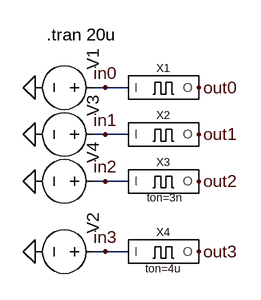
[diagram p0: schematic test-twoshot.asc]
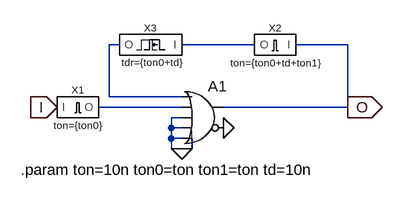
[diagram p1: sub-circuit twoshot.asc]
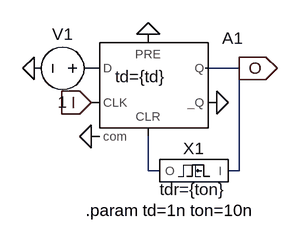
[diagram p2: sub-circuit oneshot.asc]
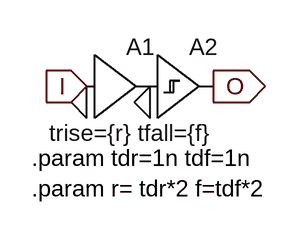
[diagram p3: sub-circuit delay.asc]
test-twoshot.asc, the LTspice schematic file:
Version 4
SHEET 1 880 680
WIRE 128 256 112 256
WIRE 160 256 128 256
WIRE 128 320 112 320
WIRE 160 320 128 320
WIRE 128 384 112 384
WIRE 160 384 128 384
WIRE 128 480 112 480
WIRE 160 480 128 480
FLAG 32 256 0
FLAG 256 256 out0
FLAG 128 256 in0
FLAG 32 320 0
FLAG 256 320 out1
FLAG 128 320 in1
FLAG 32 384 0
FLAG 256 384 out2
FLAG 128 384 in2
FLAG 32 480 0
FLAG 256 480 out3
FLAG 128 480 in3
SYMBOL voltage 128 256 M270
WINDOW 3 24 96 Invisible 2
WINDOW 123 0 0 Left 0
WINDOW 39 0 0 Left 0
SYMATTR Value PULSE(0 1 1u 1n 1n 1u 2u)
SYMATTR InstName V1
SYMBOL voltage 128 320 M270
WINDOW 3 24 96 Invisible 2
WINDOW 123 0 0 Left 0
WINDOW 39 0 0 Left 0
SYMATTR Value PULSE(0 1 1u 1n 1n 2n 2u)
SYMATTR InstName V3
SYMBOL voltage 128 384 M270
WINDOW 3 24 96 Invisible 2
WINDOW 123 0 0 Left 0
WINDOW 39 0 0 Left 0
SYMATTR Value PULSE(0 1 50n 1n 1n 10n 100n)
SYMATTR InstName V4
SYMBOL voltage 128 480 M270
WINDOW 3 24 96 Invisible 2
WINDOW 123 0 0 Left 0
WINDOW 39 0 0 Left 0
SYMATTR Value PULSE(1 0 2u 1n 1n 1u 2u)
SYMATTR InstName V2
SYMBOL twoshot 208 256 R0
SYMATTR InstName X1
SYMBOL twoshot 208 320 R0
SYMATTR InstName X2
SYMBOL twoshot 208 384 R0
WINDOW 39 2 33 Bottom 1
SYMATTR InstName X3
SYMATTR SpiceLine ton=3n
SYMBOL twoshot 208 480 R0
WINDOW 39 0 34 Bottom 1
SYMATTR InstName X4
SYMATTR SpiceLine ton=4u
TEXT 48 184 Left 2 !.tran 20u

twoshot.asc, the sub-circuit schematic file:
Version 4
SHEET 1 880 680
WIRE 128 32 112 32
WIRE 336 32 224 32
WIRE 480 32 400 32
WIRE 112 112 112 32
WIRE 224 112 112 112
WIRE 224 128 96 128
WIRE 480 128 480 32
WIRE 480 128 288 128
WIRE 224 144 208 144
WIRE 208 160 208 144
WIRE 224 160 208 160
WIRE 208 176 208 160
WIRE 224 176 208 176
WIRE 208 192 208 176
WIRE 224 192 208 192
WIRE 240 192 240 176
WIRE 240 192 224 192
FLAG 224 192 0
FLAG 288 160 0
FLAG 32 128 I
IOPIN 32 128 In
FLAG 480 128 O
IOPIN 480 128 Out
SYMBOL oneshot 64 128 R0
WINDOW 39 0 38 Bottom 1
SYMATTR SpiceLine ton={ton0}
SYMATTR InstName X1
SYMBOL oneshot 368 32 M0
WINDOW 39 0 38 Bottom 1
SYMATTR SpiceLine ton={ton0+td+ton1}
SYMATTR InstName X2
SYMBOL delay 176 32 M0
WINDOW 0 0 -16 Bottom 1
WINDOW 39 -2 37 Bottom 1
SYMATTR InstName X3
SYMATTR SpiceLine tdr={ton0+td}
SYMBOL Digital\\or 256 80 R0
SYMATTR InstName A1
TEXT -24 224 Left 2 !.param ton=10n ton0=ton ton1=ton td=10n

oneshot.asc, the sub-circuit schematic file:
Version 4
SHEET 1 880 680
WIRE 256 48 208 48
WIRE 128 192 128 144
WIRE 144 192 128 192
WIRE 256 192 256 48
WIRE 256 192 240 192
FLAG 256 48 O
IOPIN 256 48 Out
FLAG 48 96 I
IOPIN 48 96 In
FLAG 48 144 0
FLAG 128 0 0
FLAG 224 96 0
FLAG -32 48 0
SYMBOL delay 192 192 M0
WINDOW 39 1 42 Bottom 2
SYMATTR SpiceLine tdr={ton}
SYMATTR InstName X1
SYMBOL Digital\\dflop 128 0 R0
WINDOW 3 -46 60 Left 2
SYMATTR Value td={td}
SYMATTR InstName A1
SYMBOL voltage 64 48 R90
WINDOW 0 -32 56 VBottom 2
WINDOW 3 32 56 VTop 2
SYMATTR InstName V1
SYMATTR Value 1
TEXT 40 248 Left 2 !.param td=1n ton=10n

delay.asc, the sub-circuit schematic file:
Version 4
SHEET 1 880 680
FLAG 144 176 0
FLAG 208 176 0
FLAG 272 160 O
IOPIN 272 160 Out
FLAG 144 160 I
IOPIN 144 160 In
SYMBOL Digital\\buf1 144 96 R0
WINDOW 3 -38 111 Left 2
SYMATTR Value trise={r} tfall={f}
SYMATTR InstName A1
SYMBOL Digital\\schmtbuf 208 96 R0
SYMATTR InstName A2
TEXT 88 232 Left 2 !.param tdr=1n tdf=1n\n.param r= tdr*2 f=tdf*2

The netlist it stands for:
* test-twoshot.asc
V1 in0 0 PULSE(0 1 1u 1n 1n 1u 2u)
V3 in1 0 PULSE(0 1 1u 1n 1n 2n 2u)
V4 in2 0 PULSE(0 1 50n 1n 1n 10n 100n)
V2 in3 0 PULSE(1 0 2u 1n 1n 1u 2u)
XX1 out0 in0 twoshot
XX2 out1 in1 twoshot
XX3 out2 in2 twoshot params: ton=3n
XX4 out3 in3 twoshot params: ton=4u

* block symbol definitions
.subckt twoshot O I
XX1 N003 I oneshot params: ton={ton0}
XX2 N002 O oneshot params: ton={ton0+td+ton1}
XX3 N002 N001 delay params: tdr={ton0+td}
A1 N001 N003 0 0 0 0 O 0 OR
.param ton=10n ton0=ton ton1=ton td=10n
.ends twoshot

.subckt oneshot O I
XX1 O N001 delay params: tdr={ton}
A1 P001 0 I 0 N001 0 O 0 DFLOP td={td}
V1 P001 0 1
.param td=1n ton=10n
.ends oneshot

.subckt delay I O
A1 I 0 0 0 0 0 P001 0 BUF trise={r} tfall={f}
A2 P001 0 0 0 0 0 O 0 SCHMITT
.param tdr=1n tdf=1n
.param r= tdr*2 f=tdf*2
.ends delay

.tran 20u
.backanno
.end